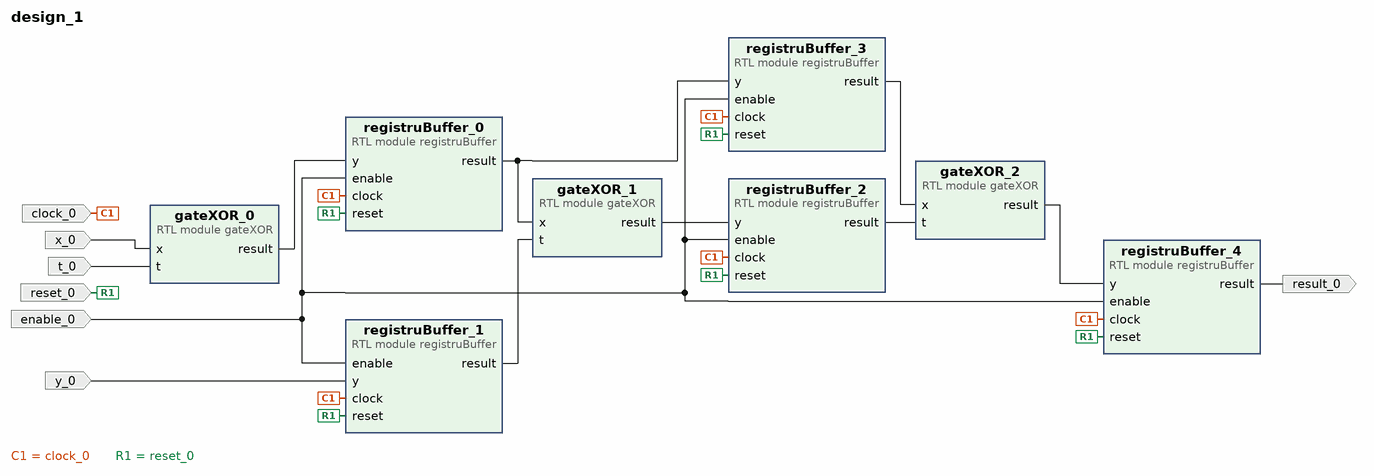
[diagram p0: block diagram of the top level]
# Vivado block design design_1, xc7a100tcsg324-1, Vivado 2020.2
create_bd_design design_1

create_bd_port -dir I y_0
create_bd_port -dir I -type clk clock_0
create_bd_port -dir I -type rst reset_0
create_bd_port -dir I enable_0
create_bd_port -dir O result_0
create_bd_port -dir I x_0
create_bd_port -dir I t_0

create_bd_cell -type module -reference gateXOR gateXOR_0
create_bd_cell -type module -reference registruBuffer registruBuffer_0
create_bd_cell -type module -reference registruBuffer registruBuffer_1
create_bd_cell -type module -reference gateXOR gateXOR_1
create_bd_cell -type module -reference registruBuffer registruBuffer_2
create_bd_cell -type module -reference registruBuffer registruBuffer_3
create_bd_cell -type module -reference gateXOR gateXOR_2
create_bd_cell -type module -reference registruBuffer registruBuffer_4

# ---- connections ----

connect_bd_net [get_bd_pins gateXOR_0/result] [get_bd_pins registruBuffer_0/y]
connect_bd_net -net y_0_1 [get_bd_ports y_0] [get_bd_pins registruBuffer_1/y]
connect_bd_net -net clock_0_1 [get_bd_ports clock_0] \
  [get_bd_pins registruBuffer_0/clock] [get_bd_pins registruBuffer_1/clock] [get_bd_pins registruBuffer_3/clock] \
  [get_bd_pins registruBuffer_2/clock] [get_bd_pins registruBuffer_4/clock]
connect_bd_net -net reset_0_1 [get_bd_ports reset_0] \
  [get_bd_pins registruBuffer_0/reset] [get_bd_pins registruBuffer_1/reset] [get_bd_pins registruBuffer_3/reset] \
  [get_bd_pins registruBuffer_2/reset] [get_bd_pins registruBuffer_4/reset]
connect_bd_net -net enable_0_1 [get_bd_ports enable_0] \
  [get_bd_pins registruBuffer_0/enable] [get_bd_pins registruBuffer_1/enable] [get_bd_pins registruBuffer_3/enable] \
  [get_bd_pins registruBuffer_2/enable] [get_bd_pins registruBuffer_4/enable]
connect_bd_net [get_bd_pins registruBuffer_1/result] [get_bd_pins gateXOR_1/t]
connect_bd_net [get_bd_pins registruBuffer_0/result] [get_bd_pins gateXOR_1/x] [get_bd_pins registruBuffer_3/y]
connect_bd_net [get_bd_pins gateXOR_1/result] [get_bd_pins registruBuffer_2/y]
connect_bd_net [get_bd_pins registruBuffer_3/result] [get_bd_pins gateXOR_2/x]
connect_bd_net [get_bd_pins registruBuffer_2/result] [get_bd_pins gateXOR_2/t]
connect_bd_net [get_bd_pins gateXOR_2/result] [get_bd_pins registruBuffer_4/y]
connect_bd_net [get_bd_pins registruBuffer_4/result] [get_bd_ports result_0]
connect_bd_net -net x_0_1 [get_bd_ports x_0] [get_bd_pins gateXOR_0/x]
connect_bd_net -net t_0_1 [get_bd_ports t_0] [get_bd_pins gateXOR_0/t]

validate_bd_design
save_bd_design
